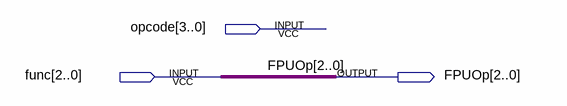
[diagram p0: schematic sheet]
// Quartus schematic FPUCtrl.bdf as structural Verilog: 0 symbols, 3 pins
module FPUCtrl (
  input  [3:0] opcode,
  input  [2:0] func,
  output [2:0] FPUOp
);


  assign FPUOp = func;
endmodule
